# EAGLE design M2k_ADG_multiplexer_board (EAGLE 7.7.0)
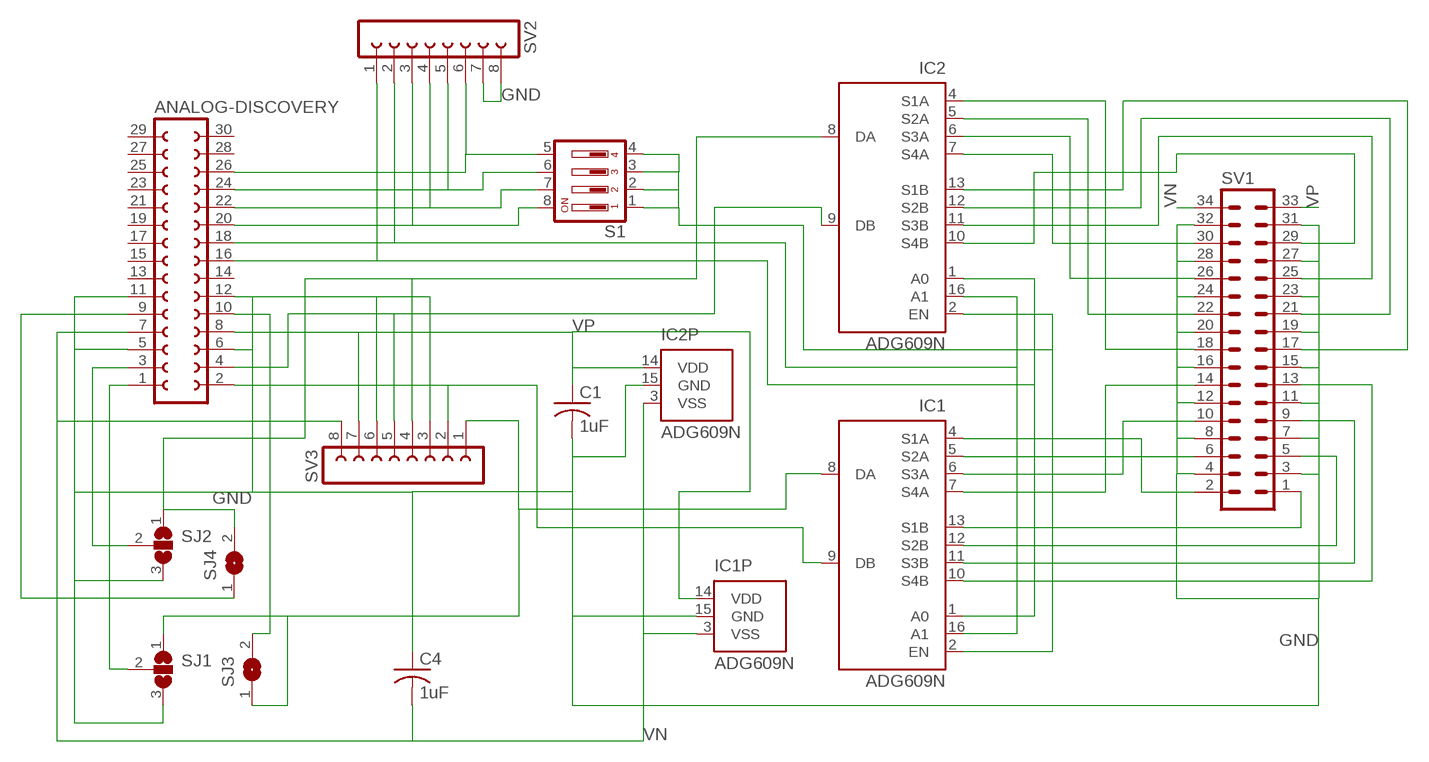
[diagram p0: schematic, sheet 1]

## Parts
ANALOG-DISCOVERY  FE15-2  [FE15-2]
C1  1uF  C-US050-024X044  [C050-024X044]
C4  1uF  C-US050-024X044  [C050-024X044]
IC1  ADG609N  [DIL16]
IC2  ADG609N  [DIL16]
S1  DIP04YL  [DIP04YL]
SJ1  SJ2W  [SJ_2]
SJ2  SJ2W  [SJ_2]
SJ3  SJ  [SJ]
SJ4  SJ  [SJ]
SV1  MA17-2  [MA17-2]
SV2  FE08-1  [FE08]
SV3  FE08-1  [FE08]

## Nets
ES: IC1.8(DA) SJ1.1 SJ3.1 SV3.1
GND: ANALOG-DISCOVERY.5 ANALOG-DISCOVERY.6 ANALOG-DISCOVERY.11 ANALOG-DISCOVERY.12 C1.2 C4.1 IC1.15(GND) IC2.15(GND) SJ1.3 SJ2.3 SV1.3 SV1.4 SV1.7 SV1.8 SV1.11 SV1.12 SV1.15 SV1.16 SV1.19 SV1.20 SV1.23 SV1.24 SV1.27 SV1.28 SV1.31 SV1.32 SV2.7 SV2.8 SV3.3 SV3.6
N$1: ANALOG-DISCOVERY.26 S1.5 SV2.6
N$3: IC1.4(S1A) SV1.2
N$4: IC1.2(EN) IC2.2(EN) S1.1 S1.2 S1.3 S1.4
N$5: ANALOG-DISCOVERY.2 IC1.9(DB) SV3.2
N$6: IC1.13(S1B) SV1.1
N$7: IC1.5(S2A) SV1.6
N$8: IC2.8(DA) SJ2.1 SJ4.2 SV3.4
N$9: IC1.12(S2B) SV1.5
N$10: IC1.6(S3A) SV1.10
N$11: ANALOG-DISCOVERY.4 IC2.9(DB) SV3.5
N$12: ANALOG-DISCOVERY.16 IC1.1(A0) IC2.1(A0) SV2.1
N$13: ANALOG-DISCOVERY.18 IC1.16(A1) IC2.16(A1) SV2.2
N$14: IC1.7(S4A) SV1.14
N$15: IC1.11(S3B) SV1.9
N$16: IC1.10(S4B) SV1.13
N$17: IC2.4(S1A) SV1.18
N$18: IC2.5(S2A) SV1.22
N$19: IC2.6(S3A) SV1.26
N$20: IC2.7(S4A) SV1.30
N$21: IC2.13(S1B) SV1.17
N$22: IC2.12(S2B) SV1.21
N$23: IC2.11(S3B) SV1.25
N$24: IC2.10(S4B) SV1.29
N$25: ANALOG-DISCOVERY.1 SJ1.2
N$26: ANALOG-DISCOVERY.3 SJ2.2
N$85: ANALOG-DISCOVERY.20 S1.8 SV2.3
N$86: ANALOG-DISCOVERY.22 S1.7 SV2.4
N$101: ANALOG-DISCOVERY.24 S1.6 SV2.5
VN: ANALOG-DISCOVERY.7 C4.2 IC1.3(VSS) IC2.3(VSS) SV1.34 SV3.8
VP: ANALOG-DISCOVERY.8 C1.1 IC1.14(VDD) IC2.14(VDD) SV1.33 SV3.7
W1: ANALOG-DISCOVERY.10 SJ3.2
W2: ANALOG-DISCOVERY.9 SJ4.1
Unconnected: ANALOG-DISCOVERY.13 ANALOG-DISCOVERY.14 ANALOG-DISCOVERY.15 ANALOG-DISCOVERY.17 ANALOG-DISCOVERY.19 ANALOG-DISCOVERY.21 ANALOG-DISCOVERY.23 ANALOG-DISCOVERY.25 ANALOG-DISCOVERY.27 ANALOG-DISCOVERY.28 ANALOG-DISCOVERY.29 ANALOG-DISCOVERY.30

## Library data of the parts
ANALOG-DISCOVERY = con-lsta:FE15-2: FEMALE HEADER; OC_FARNELL: unknown; OC_NEWARK: unknown
C1 C4 = rcl:C-US: CAPACITOR, American symbol
IC1 IC2 = analog-devices:ADG609: 3 V/5 V, 4 Channel High Performance Analog Multiplexers Source: ADG608_609.pdf; MF: ALTERA CORPORATION; MPN: ADG609BN; OC_FARNELL: 1438945; OC_NEWARK: 66F3790
S1 = switch-dil:DIP04YL: DIL/CODE SWITCH; OC_FARNELL: unknown; OC_NEWARK: unknown
SJ1 SJ2 = jumper:SJ2W: SMD solder JUMPER
SJ3 SJ4 = jumper:SJ: SMD solder JUMPER
SV1 = con-lstb:MA17-2: PIN HEADER; OC_FARNELL: unknown; OC_NEWARK: unknown
SV2 SV3 = con-lsta:FE08-1: FEMALE HEADER; OC_FARNELL: unknown; OC_NEWARK: unknown

## Board
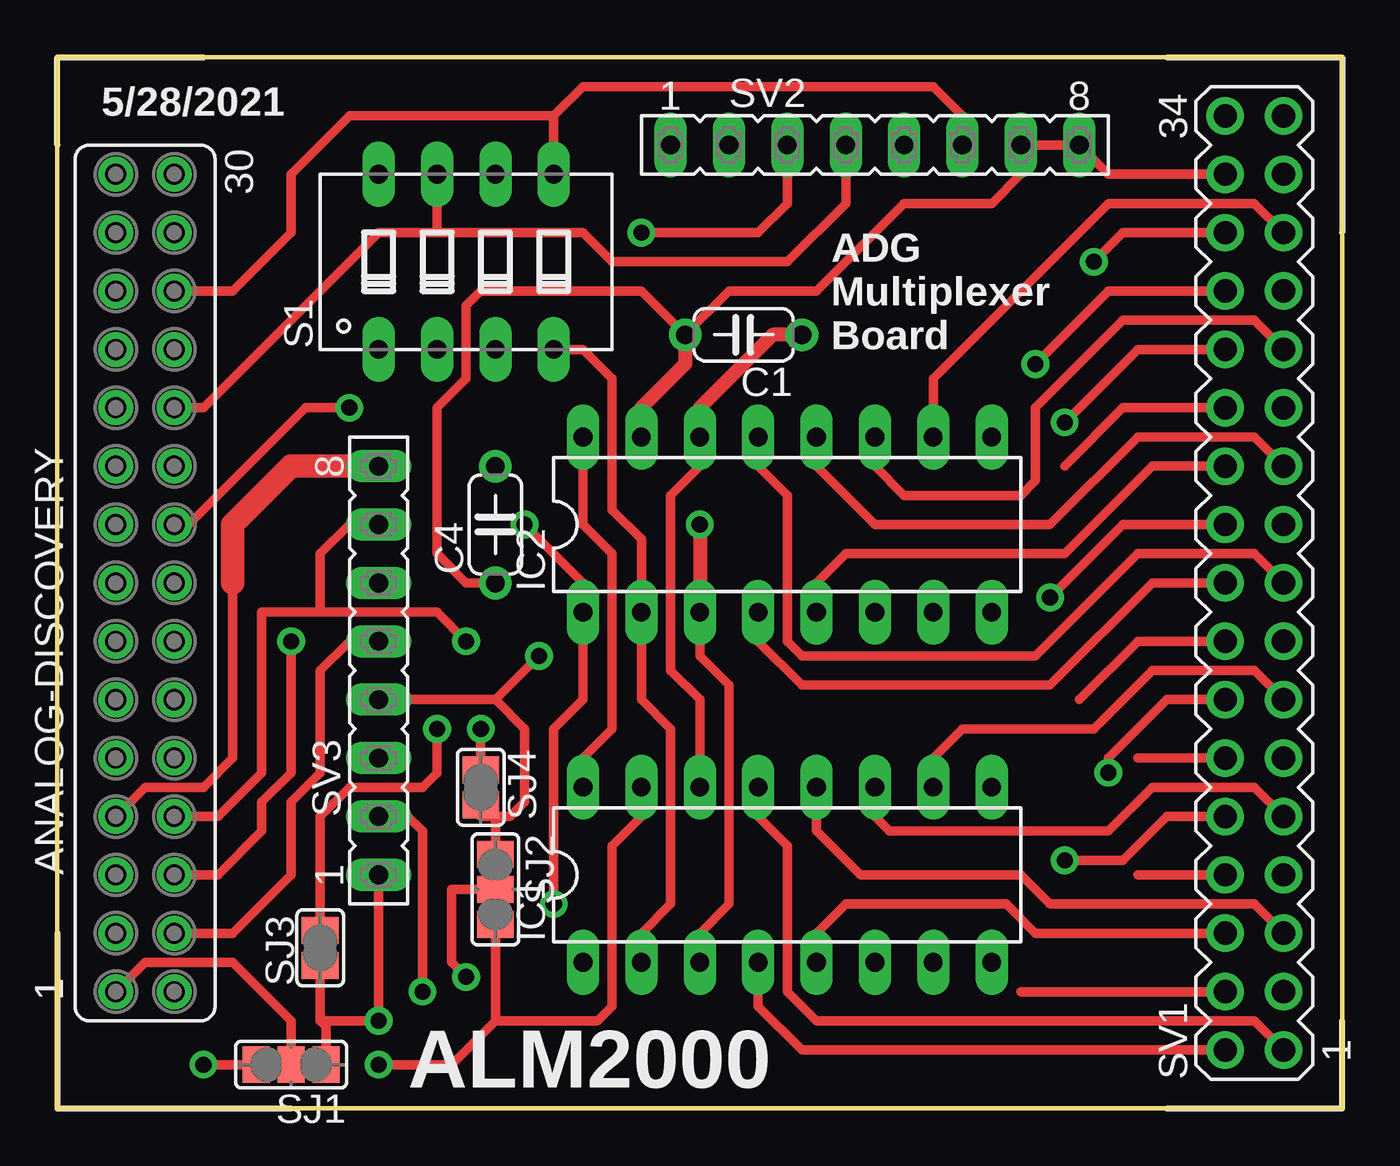
[diagram p1: board, top side]
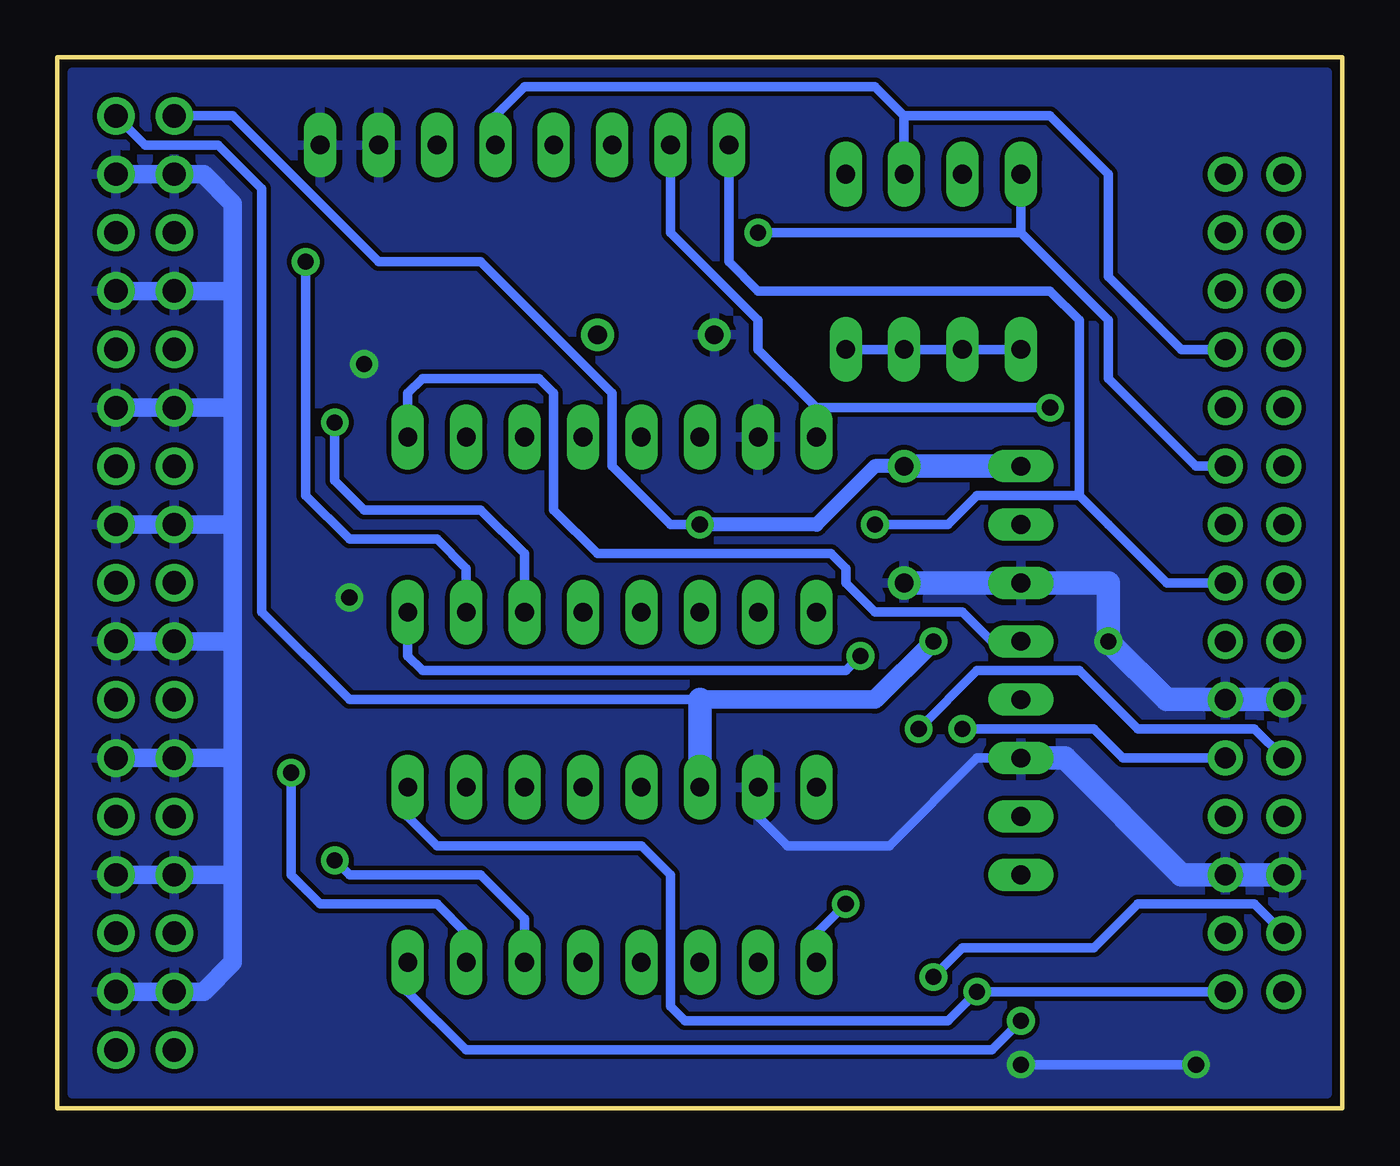
[diagram p2: board, bottom side, seen from below]

Size 55.88 x 45.72 mm. Coordinates in mm from the lower left corner, seen from the top.
Outline: 55.88,0 55.88,45.72 0,45.72 0,0 55.88,0
Copper layers (1*16): Top 0.035mm / dielectric 1.5mm / Bottom 0.035mm
Design rules "default": minimum track width 8mil, minimum drill 20mil, track to track 8mil, track to pad 8mil, pad to pad 8mil, via to via 8mil, smd to smd 8mil, copper to edge 8mil, drill to drill 8mil, minimum pad ring 12mil, minimum via ring 10mil, stop-mask expansion 4mil, vias tented up to drill 20mil, thermal gap 10mil

### Footprints (pad centres in the part's own frame; a part is rotated, then mirrored left to right if it is on the bottom)
FE15-2 = drill 0.914: 1 -17.78,1.27; 2 -17.78,-1.27; 3 -15.24,1.27; 4 -15.24,-1.27; 5 -12.7,1.27; 6 -12.7,-1.27; 7 -10.16,1.27; 8 -10.16,-1.27; 9 -7.62,1.27; 10 -7.62,-1.27; 11 -5.08,1.27; 12 -5.08,-1.27; 13 -2.54,1.27; 14 -2.54,-1.27; 15 0,1.27; 16 0,-1.27; 17 2.54,1.27; 18 2.54,-1.27; 19 5.08,1.27; 20 5.08,-1.27; 21 7.62,1.27; 22 7.62,-1.27; 23 10.16,1.27; 24 10.16,-1.27; 25 12.7,1.27; 26 12.7,-1.27; 27 15.24,1.27; 28 15.24,-1.27; 29 17.78,1.27; 30 17.78,-1.27
C050-024X044 = drill 0.813: 1 -2.54,0; 2 2.54,0
DIL16 = drill 0.813 long: 1 -8.89,-3.81; 2 -6.35,-3.81; 3 -3.81,-3.81; 4 -1.27,-3.81; 5 1.27,-3.81; 6 3.81,-3.81; 7 6.35,-3.81; 8 8.89,-3.81; 9 8.89,3.81; 10 6.35,3.81; 11 3.81,3.81; 12 1.27,3.81; 13 -1.27,3.81; 14 -3.81,3.81; 15 -6.35,3.81; 16 -8.89,3.81
DIP04YL = drill 0.813 long: 1 -3.81,-3.81; 2 -1.27,-3.81; 3 1.27,-3.81; 4 3.81,-3.81; 5 3.81,3.81; 6 1.27,3.81; 7 -1.27,3.81; 8 -3.81,3.81
SJ_2 = smd 1.168 x 1.6: 1 -1.524,0; 2 0,0; 3 1.524,0
SJ = smd 1.168 x 1.6: 1 -0.762,0; 2 0.762,0
MA17-2 = drill 1.016: 1 -20.32,-1.27; 2 -20.32,1.27; 3 -17.78,-1.27; 4 -17.78,1.27; 5 -15.24,-1.27; 6 -15.24,1.27; 7 -12.7,-1.27; 8 -12.7,1.27; 9 -10.16,-1.27; 10 -10.16,1.27; 11 -7.62,-1.27; 12 -7.62,1.27; 13 -5.08,-1.27; 14 -5.08,1.27; 15 -2.54,-1.27; 16 -2.54,1.27; 17 0,-1.27; 18 0,1.27; 19 2.54,-1.27; 20 2.54,1.27; 21 5.08,-1.27; 22 5.08,1.27; 23 7.62,-1.27; 24 7.62,1.27; 25 10.16,-1.27; 26 10.16,1.27; 27 12.7,-1.27; 28 12.7,1.27; 29 15.24,-1.27; 30 15.24,1.27; 31 17.78,-1.27; 32 17.78,1.27; 33 20.32,-1.27; 34 20.32,1.27
FE08 = drill 0.813 long: 1 -8.89,0; 2 -6.35,0; 3 -3.81,0; 4 -1.27,0; 5 1.27,0; 6 3.81,0; 7 6.35,0; 8 8.89,0

### Placement (x,y rotation side)
ANALOG-DISCOVERY  3.81,22.86 90 top
C1  29.84,33.66 180 top
C4  19.05,25.4 90 top
IC1  31.75,10.16 0 top
IC2  31.75,25.4 0 top
S1  17.78,36.83 0 top
SJ1  10.16,1.91 180 top
SJ2  19.05,9.53 270 top
SJ3  11.43,6.99 90 top
SJ4  18.41,13.97 270 top
SV1  52.07,22.86 90 top
SV2  35.56,41.91 0 top
SV3  13.97,19.05 90 top

### Tracks (layer width: path | path; a pad name or v marks a point on that pad's centre or on a via)
ES  (via drill 0.7)
  Top 0.406: SV3.1 v13.97,3.81 11.43,3.81 | 11.43,3.81 SJ3.1 | SJ1.1 11.68,3.56 11.43,3.81
  Bottom 0.406: v13.97,3.81 15.24,2.54 38.1,2.54 40.64,5.08 IC1.8
GND  (via drill 0.7)
  Top 0.406: SV1.20 46.35,25.4 v43.18,22.23 | SV1.28 45.72,35.56 v42.55,32.38 | SV1.16 46.99,20.32 44.45,17.78 | 46.99,15.24 SV1.12 | 46.99,10.16 SV1.8 | SV1.4 41.91,5.08 | SV1.24 46.35,30.48 43.81,27.94 | SJ1.3 v6.35,1.91 | v13.97,1.91 17.14,1.91 19.05,3.81 | 19.05,3.81 SJ2.3 | ANALOG-DISCOVERY.6 6.99,10.16 8.89,12.06 8.89,13.34 10.16,14.61 v10.16,20.32 | SV1.32 45.72,40.64 SV2.8 SV2.7 41.91,40.64 40.64,39.37 36.83,39.37 33.02,35.56 29.21,35.56 C1.2 25.4,35.56 18.41,35.56 17.78,34.92 17.78,31.75 16.51,30.48 16.51,24.13 17.78,22.86 C4.1 | IC1.15 25.4,12.7 24.13,11.43 24.13,4.45 23.5,3.81 19.05,3.81
  Top 0.61: C1.2 27.3,32.38 25.4,30.48 IC2.15
  Bottom 0.406: v6.35,1.91 v13.97,1.91 | SV3.3 15.88,15.24 19.68,11.43 24.13,11.43 25.4,12.7 IC1.15
  Bottom 0.813: SV1.3 SV1.4 49.53,5.08 48.26,6.35 48.26,10.16 | SV1.7 SV1.8 48.26,10.16 | SV1.11 SV1.12 48.26,15.24 | SV1.15 SV1.16 48.26,20.32 | SV1.19 SV1.20 48.26,25.4 | SV1.23 SV1.24 48.26,30.48 | SV1.27 SV1.28 48.26,35.56 | SV1.31 SV1.32 49.53,40.64 48.26,39.37 48.26,35.56 | 48.26,35.56 48.26,30.48 | 48.26,30.48 48.26,25.4 | 48.26,25.4 48.26,20.32 | 48.26,20.32 48.26,15.24 | 48.26,15.24 48.26,10.16
  Bottom 1.016: ANALOG-DISCOVERY.5 ANALOG-DISCOVERY.6 6.99,10.16 12.06,15.24 SV3.3 | ANALOG-DISCOVERY.11 ANALOG-DISCOVERY.12 7.62,17.78 v10.16,20.32 10.16,22.86 SV3.6 C4.1
  pour Bottom: 0.64,45.09 0.64,0.64 55.24,0.64 55.24,45.09
N$1
  Top 0.406: ANALOG-DISCOVERY.26 7.62,35.56 10.16,38.1 10.16,39.37 10.16,40.64 12.7,43.18 21.59,43.18 | 21.59,43.18 S1.5 | SV2.6 39.37,43.18 38.1,44.45 22.86,44.45 21.59,43.18
N$3
  Top 0.406: SV1.2 32.38,2.54 30.48,4.45 IC1.4
N$4
  Top 0.406: S1.4 22.86,33.02 24.13,31.75 24.13,26.04 25.4,24.77 IC2.2 25.4,17.78 26.67,16.51 26.67,8.89 25.4,7.62 IC1.2
  Bottom 0.406: S1.4 S1.3 S1.2 S1.1
N$5  (via drill 0.7)
  Top 0.406: SV3.2 15.24,12.7 15.88,12.06 v15.88,5.08
  Bottom 0.406: ANALOG-DISCOVERY.2 v15.88,5.08 17.14,3.81 28.57,3.81 29.21,4.45 29.21,10.16 30.48,11.43 39.37,11.43 40.64,12.7 IC1.9
N$6
  Top 0.406: SV1.1 52.07,3.81 33.02,3.81 31.75,5.08 31.75,11.43 30.48,12.7 IC1.13
N$7
  Top 0.406: SV1.6 42.55,7.62 41.27,8.89 34.29,8.89 33.02,7.62 IC1.5
N$8  (via drill 0.7)
  Top 0.406: 19.05,17.78 SV3.4 | 19.05,17.78 v20.95,19.68 | 19.05,17.78 20.32,16.51 20.32,13.34 19.68,12.7 19.05,12.7 | SJ4.2 18.41,12.7 19.05,12.7 | SJ2.1 19.05,12.7
  Bottom 0.406: v20.95,19.68 21.59,19.05 40.01,19.05 40.64,19.68 IC2.8
N$9
  Top 0.406: SV1.5 52.07,8.89 43.18,8.89 41.91,10.16 34.92,10.16 33.02,12.06 IC1.12
N$10  (via drill 0.7)
  Top 0.406: SV1.10 48.26,12.7 46.35,10.79 v43.81,10.79
  Bottom 0.406: v43.81,10.79 43.18,10.16 37.47,10.16 35.56,8.26 IC1.6
N$11
  Top 0.406: ANALOG-DISCOVERY.4 7.62,7.62 10.16,10.16 10.16,13.34 11.43,14.61 11.43,19.05 12.7,20.32 SV3.5
  Bottom 0.406: SV3.5 15.24,20.32 16.51,21.59 20.32,21.59 21.59,22.86 21.59,23.5 22.23,24.13 32.38,24.13 34.29,26.04 34.29,31.11 34.92,31.75 40.01,31.75 40.64,31.11 IC2.9
N$12  (via drill 0.7)
  Top 0.406: v21.59,8.89 21.59,16.51 22.86,17.78 IC2.1 22.86,22.86 v20.32,25.4
  Bottom 0.406: SV2.1 26.67,36.83 25.4,35.56 12.7,35.56 11.43,34.29 11.43,26.67 | ANALOG-DISCOVERY.16 7.62,22.86 10.16,25.4 11.43,26.67 | IC1.1 22.86,7.62 v21.59,8.89 | v20.32,25.4 17.14,25.4 15.88,26.67 11.43,26.67
N$13  (via drill 0.7)
  Top 0.406: ANALOG-DISCOVERY.18 5.71,25.4 10.79,30.48 v12.7,30.48 | IC1.16 22.86,15.24 24.13,16.51 24.13,24.13 22.86,25.4 IC2.16
  Bottom 0.406: v12.7,30.48 22.86,30.48 | SV2.2 29.21,38.1 25.4,34.29 25.4,33.02 22.86,30.48 | 22.86,30.48 IC2.16
N$14  (via drill 0.7)
  Top 0.406: SV1.14 48.26,17.78 45.72,15.24 v45.72,14.61
  Bottom 0.406: v45.72,14.61 45.72,10.16 44.45,8.89 39.37,8.89 38.1,7.62 IC1.7
N$15
  Top 0.406: SV1.9 52.07,13.97 47.62,13.97 45.72,12.06 36.2,12.06 35.56,12.7 IC1.11
N$16
  Top 0.406: SV1.13 52.07,19.05 47.62,19.05 45.09,16.51 39.37,16.51 38.1,15.24 IC1.10
N$17
  Top 0.406: SV1.18 47.62,22.86 43.18,18.41 32.38,18.41 30.48,20.32 IC2.4
N$18
  Top 0.406: SV1.22 47.62,27.94 43.81,24.13 34.29,24.13 33.02,22.86 IC2.5
N$19  (via drill 0.7)
  Top 0.406: v43.81,29.84 46.99,33.02 SV1.26
  Bottom 0.406: v43.81,29.84 43.81,27.3 42.55,26.04 37.47,26.04 35.56,24.13 IC2.6
N$20  (via drill 0.7)
  Top 0.406: SV1.30 46.35,38.1 v45.09,36.83
  Bottom 0.406: IC2.7 38.1,23.5 39.37,24.77 43.18,24.77 45.09,26.67 v45.09,36.83
N$21
  Top 0.406: SV1.17 52.07,24.13 46.99,24.13 42.55,19.68 32.38,19.68 31.75,20.32 31.75,26.67 30.48,27.94 IC2.13
N$22
  Top 0.406: SV1.21 52.07,29.21 46.99,29.21 43.18,25.4 35.56,25.4 33.02,27.94 IC2.12
N$23
  Top 0.406: SV1.25 52.07,34.29 46.35,34.29 42.55,30.48 42.55,27.3 41.91,26.67 36.83,26.67 35.56,27.94 IC2.11
N$24
  Top 0.406: SV1.29 52.07,39.37 45.72,39.37 38.1,31.75 IC2.10
N$25
  Top 0.406: ANALOG-DISCOVERY.1 3.81,6.35 7.62,6.35 10.16,3.81 SJ1.2
N$26  (via drill 0.7)
  Top 0.406: v17.78,5.71 17.14,6.35 17.14,9.53 SJ2.2
  Bottom 0.406: ANALOG-DISCOVERY.3 3.81,8.89 8.89,8.89 10.79,6.99 16.51,6.99 v17.78,5.71
N$85  (via drill 0.7)
  Top 0.406: SV2.3 31.75,39.37 30.48,38.1 v25.4,38.1
  Bottom 0.406: ANALOG-DISCOVERY.20 6.35,27.94 10.16,31.75 10.16,34.29 13.97,38.1 | S1.8 13.97,38.1 | 13.97,38.1 v25.4,38.1
N$86
  Top 0.406: ANALOG-DISCOVERY.22 6.35,30.48 13.97,38.1 16.51,38.1 | 16.51,38.1 S1.7 | SV2.4 34.29,39.37 31.75,36.83 24.13,36.83 22.86,38.1 16.51,38.1
N$101
  Bottom 0.406: ANALOG-DISCOVERY.24 6.99,33.02 10.16,36.2 10.16,40.64 12.7,43.18 19.05,43.18 | 19.05,43.18 S1.6 | SV2.5 36.83,43.18 35.56,44.45 20.32,44.45 19.05,43.18
VN  (via drill 0.7)
  Top 0.406: ANALOG-DISCOVERY.7 3.81,13.97 6.35,13.97 7.62,15.24 7.62,22.86 | IC1.3 27.94,7.62 29.21,8.89 29.21,18.41 27.94,19.68 IC2.3
  Top 0.61: v27.94,25.4 IC2.3
  Top 1.016: 7.62,22.86 7.62,25.4 10.16,27.94 SV3.8
  Bottom 0.406: v27.94,25.4 29.21,25.4 31.75,27.94 31.75,31.11 37.47,36.83 41.91,36.83 48.26,43.18 SV1.34
  Bottom 0.61: C4.2 20.32,27.94 22.86,25.4 v27.94,25.4
  Bottom 1.016: SV3.8 C4.2
VP  (via drill 0.7)
  Top 0.406: ANALOG-DISCOVERY.8 6.99,12.7 8.89,14.61 8.89,21.59 11.43,21.59 | 11.43,21.59 11.43,24.13 12.7,25.4 SV3.7 | 11.43,21.59 16.51,21.59 v17.78,20.32 | IC2.14 27.94,27.94 26.67,26.67 26.67,19.05 27.94,17.78 IC1.14
  Top 0.61: C1.1 31.11,33.66 27.94,30.48 IC2.14
  Bottom 0.406: SV1.33 52.07,41.91 48.9,41.91 46.99,40.01 46.99,21.59 43.18,17.78 27.94,17.78
  Bottom 0.813: v17.78,20.32 20.32,17.78 27.94,17.78
  Bottom 1.016: IC1.14 27.94,17.78
W1  (via drill 0.7)
  Top 0.406: v16.51,16.51 16.51,14.61 15.88,13.97 12.7,13.97 11.43,12.7 SJ3.2
  Bottom 0.406: ANALOG-DISCOVERY.10 9.53,15.24 10.79,16.51 v16.51,16.51
W2  (via drill 0.7)
  Top 0.406: SJ4.1 v18.41,16.51
  Bottom 0.406: ANALOG-DISCOVERY.9 3.81,16.51 8.89,16.51 11.43,19.05 15.88,19.05 v18.41,16.51

### Text on the board
tPlace: 5/28/2021 | ADG | Multiplexer | Board | ALM2000